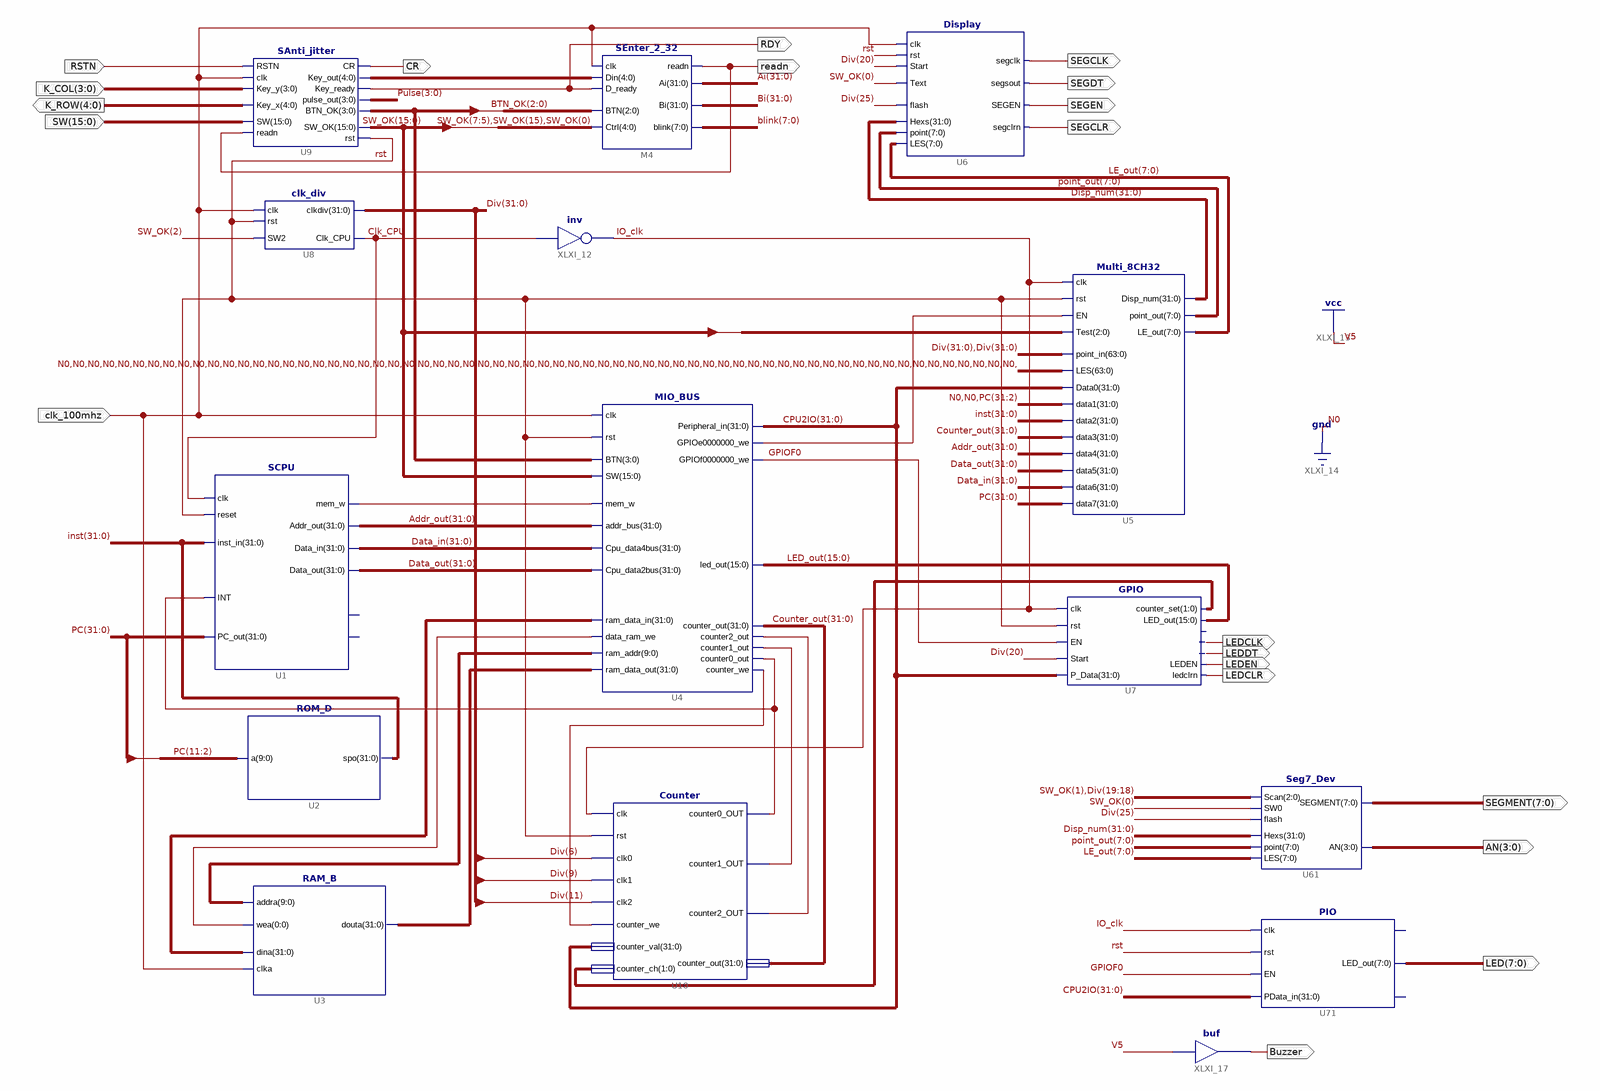
[diagram p0: schematic sheet 1]
// Xilinx ISE schematic Framework.sch (kintex7) as structural Verilog: 15 symbols, 20 ports
module Framework (
  input  clk_100mhz,
  input  RSTN,
  input  [3:0] K_COL,
  input  [15:0] SW,
  output [4:0] K_ROW,
  output readn,
  output CR,
  output RDY,
  output SEGCLK,
  output SEGDT,
  output SEGEN,
  output SEGCLR,
  output LEDCLK,
  output LEDDT,
  output LEDEN,
  output LEDCLR,
  output [7:0] SEGMENT,
  output [3:0] AN,
  output [7:0] LED,
  output Buzzer
);

  wire Clk_CPU, GPIOF0, IO_clk, rst, XLXN_83, XLXN_88, XLXN_89, XLXN_94, XLXN_97, XLXN_111;
  wire [0:0] XLXN_106;
  wire [1:0] XLXN_102;
  wire [3:0] BTN_OK, Pulse;
  wire [4:0] XLXN_15;
  wire [7:0] blink, LE_out, point_out;
  wire [9:0] XLXN_105;
  wire [15:0] LED_out, SW_OK;
  wire [31:0] Addr_out, Ai, Bi, Counter_out, CPU2IO, Data_in, Data_out, Disp_num, Div, inst, PC, XLXN_104,
       XLXN_108;

  buf XLXI_17 (Buzzer, 1'b1);
  RAM_B U3 (.addra(XLXN_105), .clka(clk_100mhz), .wea(XLXN_106[0]), .dina(XLXN_108), .douta(XLXN_104));
  Counter U10 (
    .clk(IO_clk), .rst(rst), .clk0(Div[6]), .clk1(Div[9]), .clk2(Div[11]), .counter_we(XLXN_97),
    .counter_val(CPU2IO), .counter_ch(XLXN_102), .counter0_OUT(XLXN_94), .counter1_OUT(XLXN_89),
    .counter2_OUT(XLXN_88), .counter_out(Counter_out));
  MIO_BUS U4 (
    .rst(rst), .clk(clk_100mhz), .mem_w(XLXN_111), .addr_bus(Addr_out), .Cpu_data4bus(Data_in),
    .Cpu_data2bus(Data_out), .ram_data_out(XLXN_104), .ram_addr(XLXN_105), .data_ram_we(XLXN_106[0]),
    .ram_data_in(XLXN_108), .counter_out(Counter_out), .counter2_out(XLXN_88), .counter1_out(XLXN_89),
    .counter0_out(XLXN_94), .counter_we(XLXN_97), .BTN(BTN_OK), .SW(SW_OK), .led_out(LED_out),
    .Peripheral_in(CPU2IO), .GPIOe0000000_we(XLXN_83), .GPIOf0000000_we(GPIOF0));
  SAnti_jitter U9 (
    .SW(SW), .readn(readn), .Key_y(K_COL), .Key_x(K_ROW), .RSTN(RSTN), .clk(clk_100mhz), .Key_out(XLXN_15),
    .Key_ready(RDY), .CR(CR), .rst(rst), .SW_OK(SW_OK), .pulse_out(Pulse), .BTN_OK(BTN_OK));
  SEnter_2_32 M4 (
    .readn(readn), .Ai(Ai), .Bi(Bi), .blink(blink), .Din(XLXN_15), .D_ready(RDY), .clk(clk_100mhz),
    .Ctrl({SW_OK[7:5], SW_OK[15], SW_OK[0]}), .BTN(BTN_OK[2:0]));
  clk_div U8 (.rst(rst), .clk(clk_100mhz), .SW2(SW_OK[2]), .clkdiv(Div), .Clk_CPU(Clk_CPU));
  ROM_D U2 (.a(PC[11:2]), .spo(inst));
  Multi_8CH32 U5 (
    .Test(SW_OK[7:5]), .point_in({Div, Div}), .EN(XLXN_83), .clk(IO_clk), .rst(rst), .LES({64{1'b0}}),
    .Data0(CPU2IO), .data1({2'b00, PC[31:2]}), .data2(inst), .data3(Counter_out), .data4(Addr_out),
    .data5(Data_out), .data6(Data_in), .data7(PC), .point_out(point_out), .LE_out(LE_out), .Disp_num(Disp_num));
  GPIO U7 (
    .clk(IO_clk), .P_Data(CPU2IO), .rst(rst), .EN(GPIOF0), .Start(Div[20]), .ledclk(LEDCLK),
    .LED_out(LED_out), .counter_set(XLXN_102), .ledclrn(LEDCLR), .LEDEN(LEDEN), .ledsout(LEDDT));  // open: GPIOf0
  not XLXI_12 (IO_clk, Clk_CPU);
  Display U6 (
    .LES(LE_out), .SEGEN(SEGEN), .segsout(SEGDT), .segclrn(SEGCLR), .point(point_out), .Hexs(Disp_num),
    .Text(SW_OK[0]), .flash(Div[25]), .segclk(SEGCLK), .clk(clk_100mhz), .rst(rst), .Start(Div[20]));
  Seg7_Dev U61 (
    .LES(LE_out), .Scan({SW_OK[1], Div[19:18]}), .SEGMENT(SEGMENT), .AN(AN), .point(point_out),
    .flash(Div[25]), .SW0(SW_OK[0]), .Hexs(Disp_num));
  PIO U71 (.clk(IO_clk), .rst(rst), .EN(GPIOF0), .PData_in(CPU2IO), .LED_out(LED));  // open: GPIOf0, counter_set
  SCPU U1 (
    .clk(Clk_CPU), .reset(rst), .inst_in(inst), .INT(XLXN_94), .Addr_out(Addr_out), .mem_w(XLXN_111),
    .Data_out(Data_out), .Data_in(Data_in), .PC_out(PC));  // open: CPU_MIO, MIO_ready
endmodule
